# EAGLE design mqtt doorbell v1 (EAGLE 7.6.0)
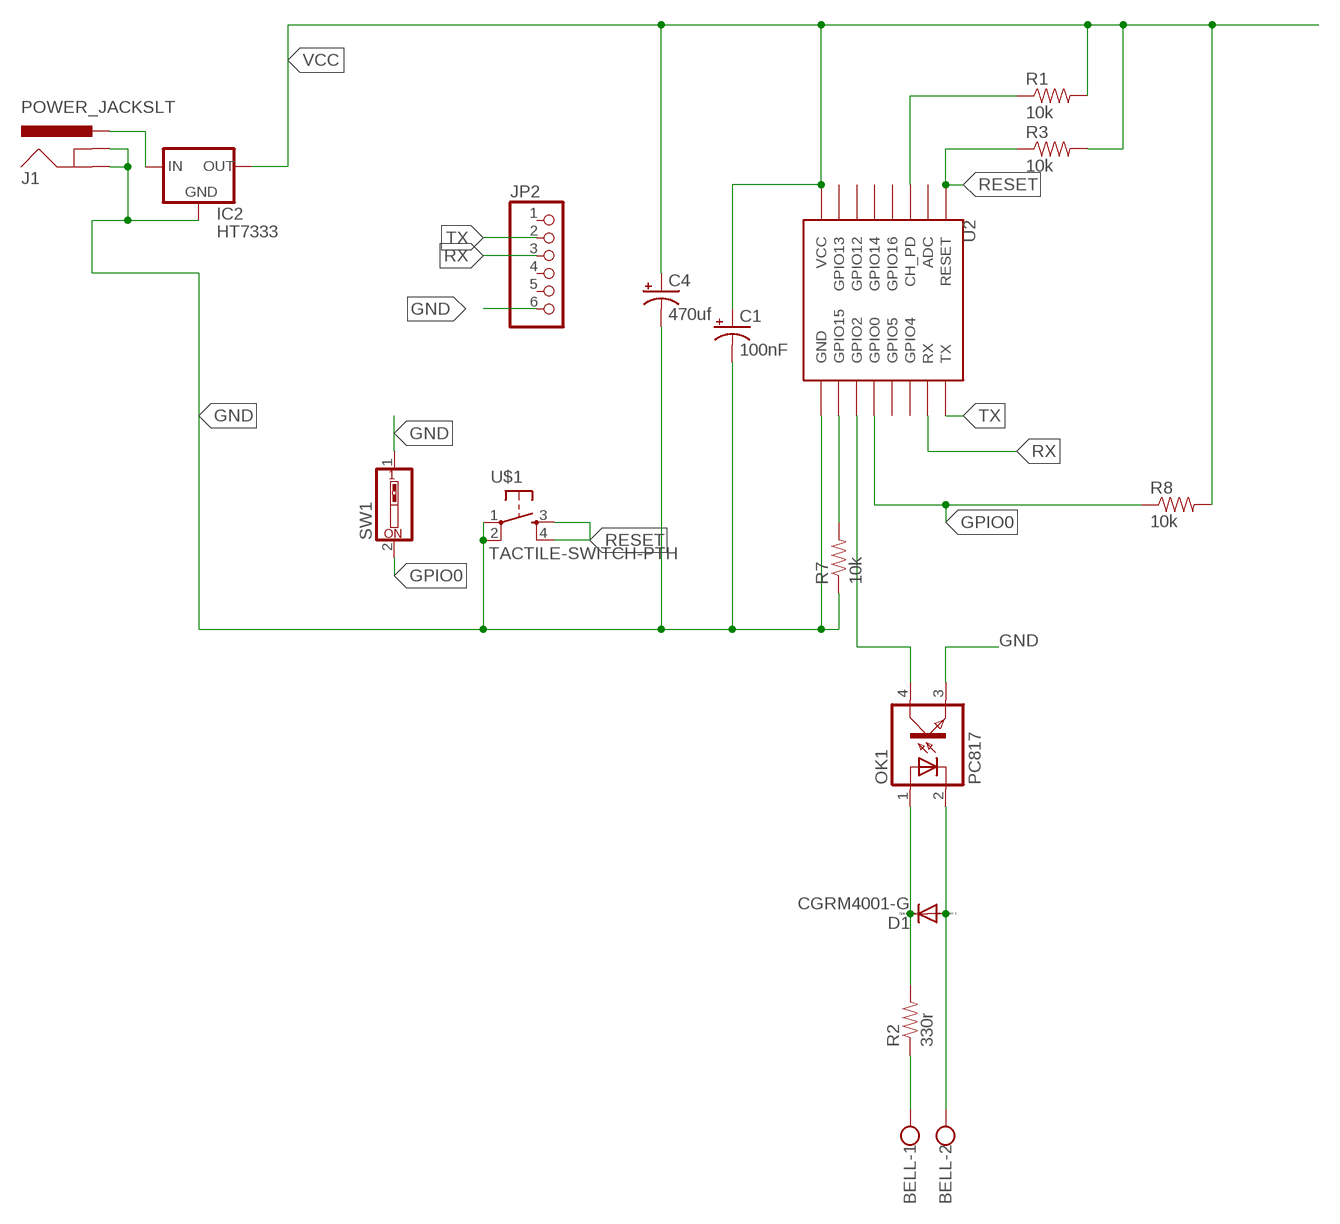
[diagram p0: schematic, sheet 1]

## Parts
BELL  W237-102  [W237-102]
C1  100nF  10UF-16V-10%(TANT)  [EIA3216]
C4  470uf  47UF-50V-20%(ELECT)  [PANASONIC_D]
D1  CGRM4001-G  [SOD-123_MINI-SMA]
IC2  HT7333  [SOT-89]
J1  POWER_JACKSLT  [POWER_JACK_SLOT]
JP2  PINHD-1X6  [1X06]
OK1  PC817  [DIL04]
R1  10k  RESISTOR1206  [1206]
R2  330r  RESISTOR1206  [1206]
R3  10k  RESISTOR1206  [1206]
R7  10k  RESISTOR1206  [1206]
R8  10k  RESISTOR1206  [1206]
SW1  SW_DIP-1  [EDG-01]
U2  ESP12SMD  [ESP12-SMD]
U$1  TACTILE-SWITCH-PTH  [TAC-SWITCH-PTH]

## Nets
GND: C1.C(-) C4.- IC2.2(GND) J1.GND@1(GNDBREAK) J1.GND@2(GND) JP2.6 OK1.3(EMIT) R7.1 SW1.1 U2.GND U$1.1 U$1.2
GPIO0: R8.1 SW1.2 U2.GPIO0
N$1: IC2.3(IN) IC2.4(IN) J1.PWR
N$2: OK1.4(COL) U2.GPIO2
N$3: D1.C OK1.1(A) R2.2
N$4: BELL.2 D1.A OK1.2(C)
N$5: R1.1 U2.CH_PD
N$6: BELL.1 R2.1
N$7: R7.2 U2.GPIO15
RESET: R3.1 U2.RESET U$1.3 U$1.4
RX: JP2.3 U2.RXD0(RX)
TX: JP2.2 U2.TXD0(TX)
VCC: C1.A(+) C4.+ IC2.1(OUT) R1.2 R3.2 R8.2 U2.VCC
Unconnected: JP2.1 JP2.4 JP2.5 U2.ADC U2.GPIO4 U2.GPIO5 U2.GPIO12 U2.GPIO13 U2.GPIO14 U2.GPIO16

## Library data of the parts
BELL = con-wago-500:W237-102: WAGO SCREW CLAMP; MPN: 237-102; OC_FARNELL: unknown; OC_NEWARK: 70K9898
C1 = SparkFun-Capacitors:10UF-16V-10%(TANT): CAP-00811 1206/EIA-3216 Tantalum capacitor; PROD_ID: CAP-00811; VALUE: 10uF
C4 = SparkFun-Capacitors:47UF-50V-20%(ELECT): CAP-10547; PROD_ID: CAP-10547
D1 = diode:CGRM400*-G: Molded plasitc,JEDEC SOD-123/Mini SMA Source: Comchip CGRM4001-G.pdf
IC2 = Lemcke solutions:HT73*
J1 = SparkFun-Connectors:POWER_JACK: Power Jack This is the standard 5.5mm barrel jack for power. The PTH is the most common, proven, reliable, footprint. The Slot footprint only works if the mill layer is transmitted to the PCB fab house so be warned. Mating wall wart : TOL-00298 (and others); PROD_ID: PRT-00119
JP2 = pinhead:PINHD-1X6: PIN HEADER
OK1 = optocoupler:PC817: SHARP OPTO COUPLER; MPN: PC817X4J000F; OC_FARNELL: 9707727; OC_NEWARK: 97K7059
R1-R3 R7 R8 = SparkFun-Passives:RESISTOR: Resistor Basic schematic elements and footprints for 0603, 1206, and PTH resistors.
SW1 = special:SW_DIP-1: DIP SWITCH
U2 = esp8266modules:ESP12: ESP8266 Wifi module 12
U$1 = GeekAmmo:TACTILE-SWITCH: Tactile Switch 4 Pins, SPST NO

## Net classes
0 default: width 0.203 mm, clearance 0.205 mm

## Board
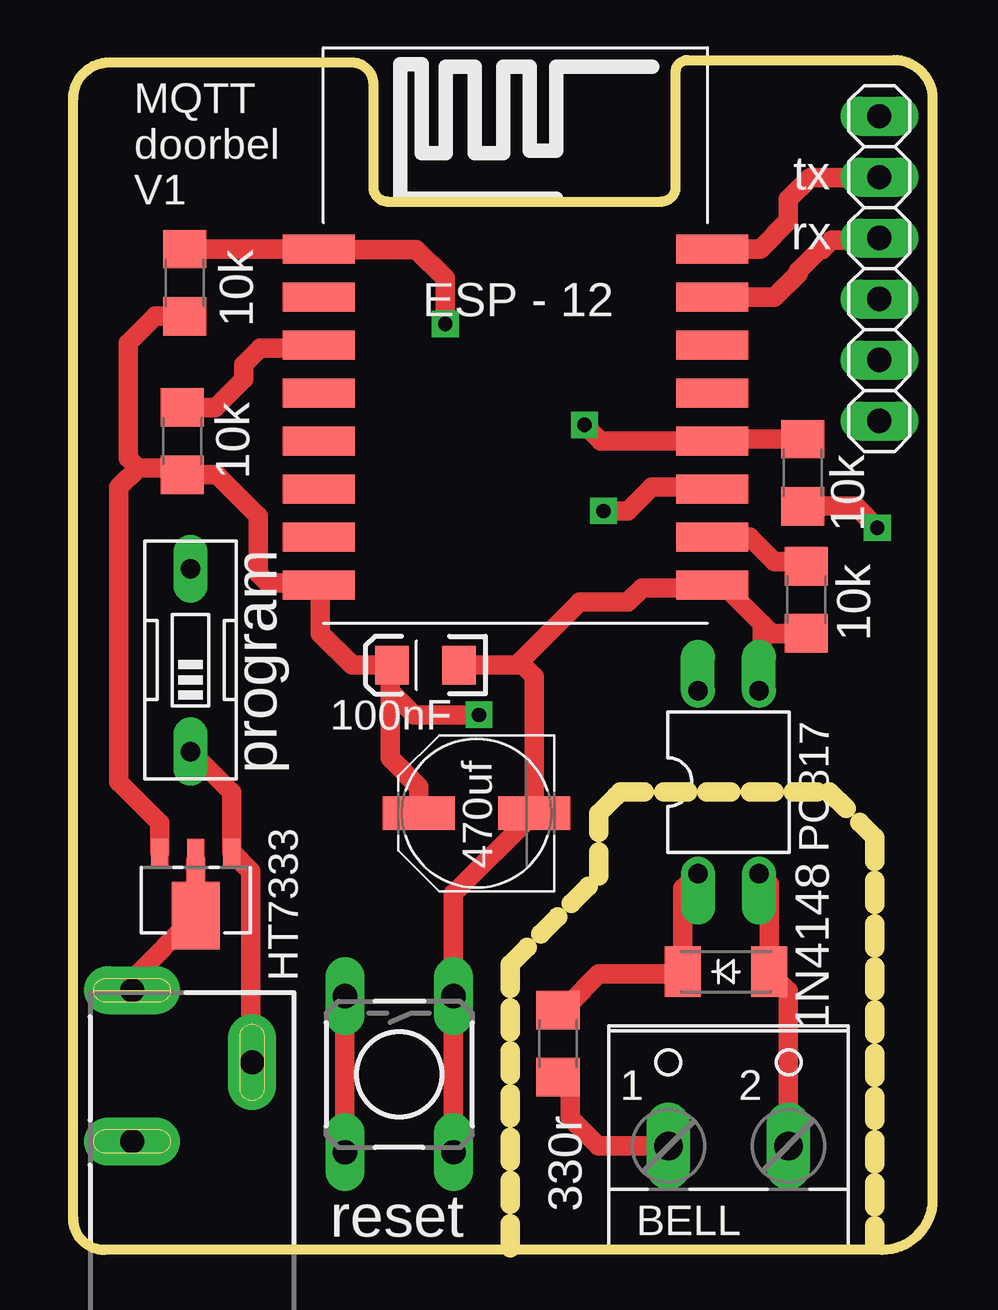
[diagram p1: board, top side]
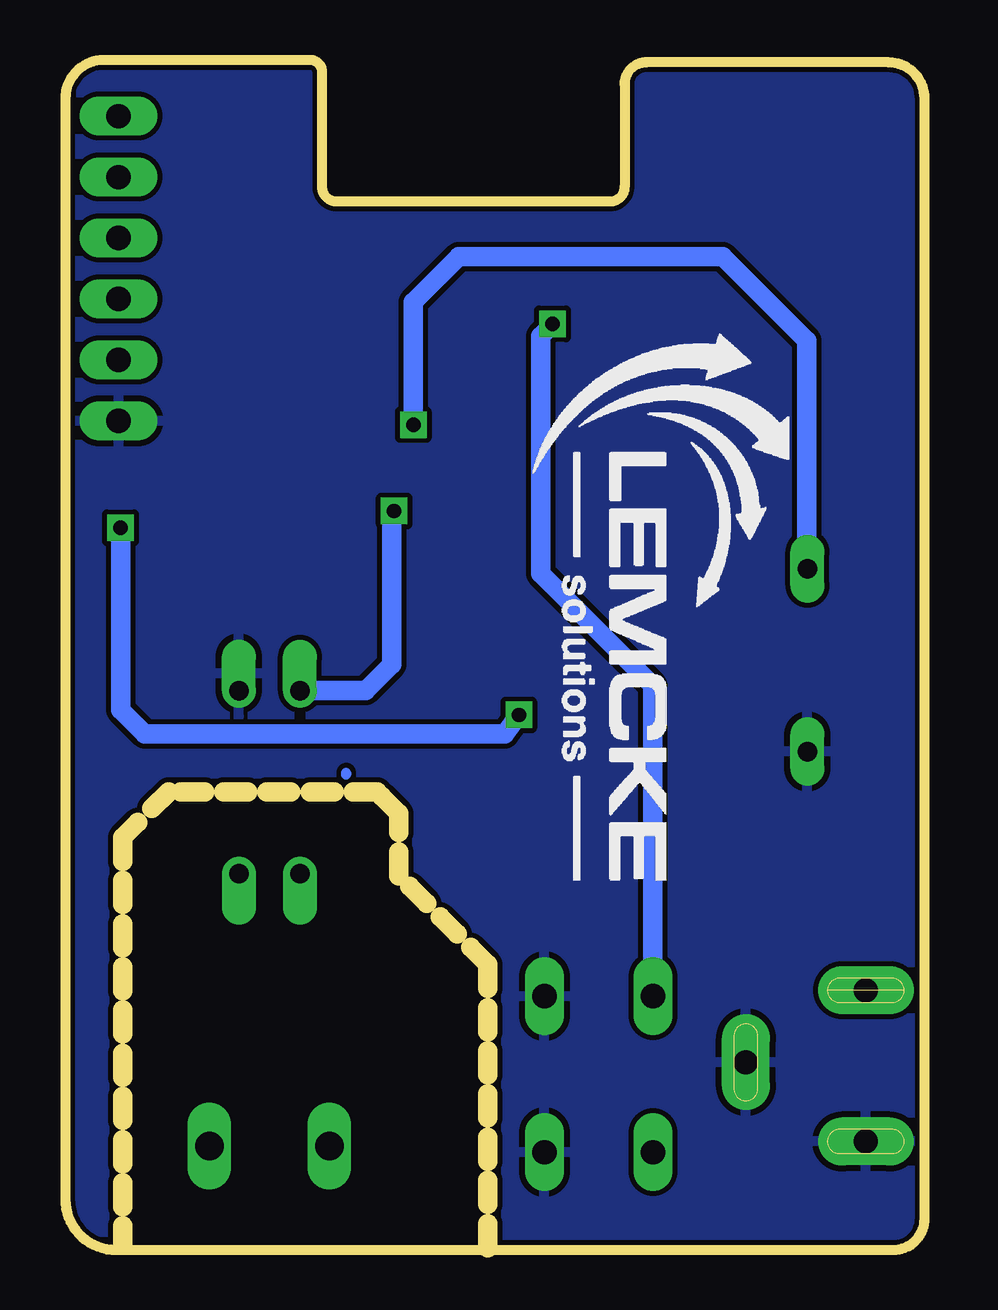
[diagram p2: board, bottom side, seen from below]

Size 35.8 x 49.6 mm. Coordinates in mm from the lower left corner, seen from the top.
Outline: 18.2,0.1 18.2,11.9 21.9,15.6 21.9,18.2 22.8,19.1 31.5,19.1 33.4,17.2 33.4,0.3
Outline: 0,1.3 0,48 arc-90 1.5,49.5 11.6,49.5 arc-90 12.5,48.6 12.5,44.3 arc90 13.1,43.7 24.5,43.7 arc90 25.1,44.3 25.1,49.1 arc-90 25.6,49.6 34.2,49.6 arc-90 35.8,48 35.8,2.1 arc-90 33.7,0 1.3,0 arc-90 0,1.3
Copper layers (1*16): Top 0.035mm / dielectric 1.5mm / Bottom 0.035mm
Design rules "SparkFun": minimum track width 8mil, minimum drill 20mil, track to track 8mil, track to pad 8mil, pad to pad 8mil, via to via 8mil, smd to smd 8mil, copper to edge 8mil, drill to drill 8mil, minimum pad ring 12mil, minimum via ring 10mil, stop-mask expansion 4mil, vias tented up to drill 20mil, thermal gap 10mil

### Footprints (pad centres in the part's own frame; a part is rotated, then mirrored left to right if it is on the bottom)
W237-102 = drill 1.194 long: 1 -2.5,-1.27; 2 2.5,-1.27
EIA3216 = smd 1.4 x 1.6: A 1.4,0; C -1.4,0
PANASONIC_D = smd 3 x 1.4: + 2.4,0; - -2.4,0
SOD-123_MINI-SMA = smd 1.5 x 2.1: A 1.8,0; C -1.8,0
SOT-89 = smd 0.7 x 1.1: 1 1.5,-2.385; 2 -1.5,-2.385 | smd 0.7 x 1.8: 3 0,-2.035 | smd 2 x 2.8: 4 0,0.265 | smd 0.635 x 1.27: P$1 0,-2.3; P$2 0,-1.6; P$3 0,-0.8; P$4 0,-0.2; P$5 0,0.3; P$6 -0.1,0.9
POWER_JACK_SLOT = drill 1 pad 2 long: GND@1 2.58,7.5; GND@2 7.58,10.8; PWR 2.58,13.8
1X06 = drill 1.016 long: 1 -6.35,0; 2 -3.81,0; 3 -1.27,0; 4 1.27,0; 5 3.81,0; 6 6.35,0
DIL04 = drill 0.813 offset: 1 -1.27,-3.81; 2 1.27,-3.81; 3 1.27,3.81; 4 -1.27,3.81
1206 = smd 1.6 x 1.8: 1 -1.4,0; 2 1.4,0
EDG-01 = drill 0.813 long: 1 0,-3.81; 2 0,3.81
ESP12-SMD = smd 3 x 1.2: ADC -8.3,3.8; CH_PD -8.3,1.8; GND 8.1,-8.2; GPIO0 8.1,-2.2; GPIO2 8.1,-4.2; GPIO4 8.1,1.8; GPIO5 8.1,-0.2; GPIO12 -8.3,-4.2; GPIO13 -8.3,-6.2; GPIO14 -8.3,-2.2; GPIO15 8.1,-6.2; GPIO16 -8.3,-0.2; RESET -8.3,5.8; RXD0 8.1,3.8; TXD0 8.1,5.8; VCC -8.3,-8.2
TAC-SWITCH-PTH = drill 1.016 pad 1.524 long: 1 -3.251,2.261; 2 3.251,2.261; 3 -3.251,-2.261; 4 3.251,-2.261

### Placement (x,y rotation side)
BELL  27.3,5.6 0 top
C1  14.67,24.37 180 top
C4  16.8,18.2 180 top
D1  27.2,11.6 0 top
IC2  5.1,14.2 180 top
J1  -0.13,-2.98 0 top
JP2  33.58,40.91 270 top
OK1  27.3,19.5 0 top
R1  4.55,33.71 270 top
R2  20.2,8.6 90 top
R3  4.65,40.31 270 top
R7  30.54,27.1 90 top
R8  30.4,32.4 270 top
SW1  4.89,24.59 0 top
U2  18.52,35.91 0 top
U$1  13.58,7.32 270 top

### Tracks (layer width: path | path; a pad name or v marks a point on that pad's centre or on a via)
GND
  Top 0.813: C1.C 18.47,24.37 18.6,24.5 | 18.6,24.5 21.1,27 23.1,27 23.7,27.6 26.51,27.6 U2.GND 27.09,27.71 28.7,26.1 | 18.6,24.5 19.2,23.9 C4.- 15.84,14.84 U$1.1 U$1.2 | 28.7,26.1 28.7,23.44 OK1.3 | J1.GND@2 7.4,10.17 7.4,15.78 IC2.2 6.6,19.06 SW1.1 | R7.1 29.1,25.7 28.7,26.1
  pour Bottom: 0.1,49.5 33.91,49.47 35.5,49.2 35.4,0.5 33.6,0.4 33.4,0.7 33.4,17.1 31.2,19.3 23.7,19.3 18.9,12.8 18.3,1.3 17.7,0.1 -0.2,0.2 -0.2,-0.1 -0.3,39.2 0,39.8
GPIO0  (via drill 0.6)
  Top 0.813: R8.1 26.71,33.8 U2.GPIO0 21.99,33.71 v21.3,34.4
  Bottom 0.813: v21.3,34.4 21.3,39.5 19.4,41.4 8.4,41.4 4.9,37.9 4.9,28.41 SW1.2
N$1
  Top 0.813: 4.75,13.58 IC2.4 | J1.PWR 2.45,11.28 IC2.4 | IC2.4 IC2.3
N$2  (via drill 0.6)
  Top 0.813: v22.1,30.8 23.1,30.8 24.1,31.8 26.54,31.8 U2.GPIO2
  Bottom 0.813: OK1.4 23.29,23.31 22.2,24.4 22.2,30.7 v22.1,30.8
N$3
  Top 0.813: OK1.1 25.4,15.06 D1.C 25.3,11.5 21.9,11.5 20.6,10.2 R2.2
N$4
  Top 0.813: BELL.2 29.8,10.8 D1.A 29,15.26 OK1.2
N$5
  Top 0.813: R1.1 5.91,35.11 7.1,36.3 7.1,36.9 7.8,37.6 10.11,37.6 U2.CH_PD
N$6
  Top 0.813: BELL.1 21.87,4.33 20.7,5.5 20.7,7.1 R2.1
N$7
  Top 0.813: U2.GPIO15 28.19,29.71 29.2,28.7 30.34,28.7 R7.2
N$8
  Bottom 0.406: 24.1,19.9 24.1,19.8
RESET  (via drill 0.6)
  Top 0.813: U$1.4 U$1.3 | v15.5,38.6 15.5,40.5 14.3,41.7 U2.RESET R3.1
  Bottom 0.813: v15.5,38.6 16,38.1 16,28.2 11.32,23.52 U$1.3
RX
  Top 0.813: U2.RXD0 29.21,39.71 30.2,40.7 30.2,40.8 31.1,41.7 31.2,41.7 31.6,42.1 33.51,42.1 JP2.3
TX
  Top 0.813: U2.TXD0 28.61,41.71 29.8,42.9 29.8,43.8 30.7,44.7 33.57,44.7 JP2.2
VCC  (via drill 0.6)
  Top 0.813: C4.+ 14.4,19.3 13.2,20.5 13.2,23.3 | 13.2,23.3 13.2,24.3 C1.A 11.63,24.37 10.3,25.7 10.3,27.64 U2.VCC 10.14,27.8 8.1,27.8 7.7,28.2 7.7,30.6 5.99,32.31 R1.2 4.26,32.6 2.7,32.6 | R3.2 3.41,38.91 2.3,37.8 2.3,33 2.7,32.6 | IC2.1 3.6,17.8 1.9,19.5 1.9,31.8 2.7,32.6 | R8.2 32.6,31 v33.5,30.1 | v16.9,22.3 14.2,22.3 13.2,23.3
  Bottom 0.813: v33.5,30.1 33.5,22.5 32.5,21.5 17.5,21.5 v16.9,22.3

### Text on the board
tPlace: tx | MQTT / doorbel / V1 | rx | 10k | 10k | 10k | program | 10k | 1N4148 | reset